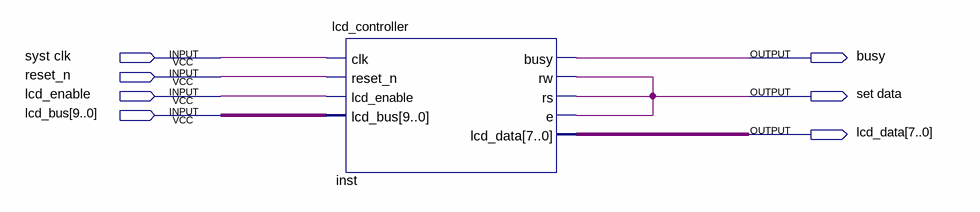
[diagram p0: schematic sheet]
// Quartus schematic lcdcontrol.bdf as structural Verilog: 1 symbols, 7 pins
module lcdcontrol (
  input  \syst_clk ,
  input  reset_n,
  input  lcd_enable,
  input  [9:0] lcd_bus,
  output busy,
  output \set_data ,
  output [7:0] lcd_data
);

  lcd_controller inst (
    .clk(\syst_clk ), .reset_n(reset_n), .lcd_enable(lcd_enable), .lcd_bus(lcd_bus), .busy(busy),
    .rw(\set_data ), .rs(\set_data ), .e(\set_data ), .lcd_data(lcd_data));
endmodule
